# Altium schematic sheet TP_IHM_7SEG_DRIVERS.SchDoc
size A4
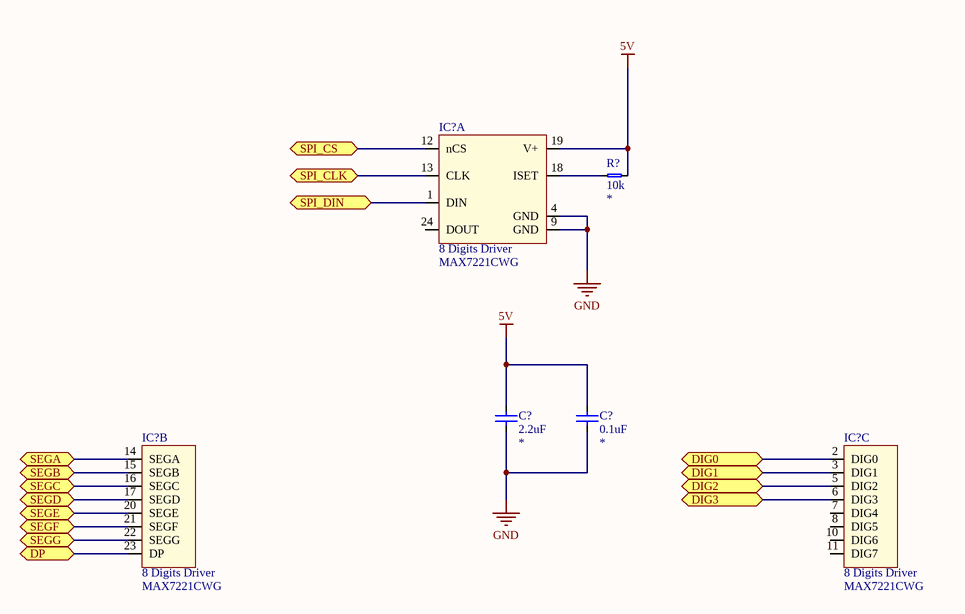
[diagram p0: TP_IHM_7SEG_DRIVERS.SchDoc]

## Parts
(Parts that share a designator on the sheet are numbered #1, #2 ... from top to bottom, then left to right.)
C?#1  value 2.2uF  [0603_CAP_LD]  (hidden comment: CerCap)
C?#2  value 0.1uF  [0603_CAP_LD]  (hidden comment: CerCap)
IC?#1  8 Digits Driver  [MAX7221CWG]  (part A of 3)
IC?#2  8 Digits Driver  [MAX7221CWG]  (part B of 3)
IC?#3  8 Digits Driver  [MAX7221CWG]  (part C of 3)
R?  value 10k  [0603_RES_LD]  (hidden comment: Resistor)

## Ports
DIG0, DIG1, DIG2, DIG3, DP, SEGA, SEGB, SEGC, SEGD, SEGE, SEGF, SEGG, SPI_CLK, SPI_CS, SPI_DIN

## Nets
5V: C?#1.2 C?#2.2 IC?#1.19(V+) R?.2
GND: C?#1.1 C?#2.1 IC?#1.4(GND) IC?#1.9(GND)
DIG0: IC?#3.2(DIG0) ; port DIG0
DIG1: IC?#3.3(DIG1) ; port DIG1
DIG2: IC?#3.5(DIG2) ; port DIG2
DIG3: IC?#3.6(DIG3) ; port DIG3
DP: IC?#2.23(DP) ; port DP
SEGA: IC?#2.14(SEGA) ; port SEGA
SEGB: IC?#2.15(SEGB) ; port SEGB
SEGC: IC?#2.16(SEGC) ; port SEGC
SEGD: IC?#2.17(SEGD) ; port SEGD
SEGE: IC?#2.20(SEGE) ; port SEGE
SEGF: IC?#2.21(SEGF) ; port SEGF
SEGG: IC?#2.22(SEGG) ; port SEGG
SPI_CLK: IC?#1.13(CLK) ; port SPI_CLK
SPI_CS: IC?#1.12(nCS) ; port SPI_CS
SPI_DIN: IC?#1.1(DIN) ; port SPI_DIN
NetIC?#1_18: IC?#1.18(ISET) R?.1

Not connected (* = marked no-connect by the designer): IC?#1 24(DOUT); IC?#3 7(DIG4) 8(DIG5) 10(DIG6) 11(DIG7)

## Library data of the parts
C?#1 C?#2 = CerCap: Ceramic Capacitor; Type: *; Voltage/Power: *; Package: *
IC?#1-IC?#3 = MAX7221: MAX7221 8 Digit 7 Segments Display; Reference: MAX7221CWG
R? = Resistor: Precision: *; Package: *